# Altium schematic sheet 05_FPGA_SOC_Part1.SchDoc
size A3; SheetNumber: 5; SheetTotal: 8
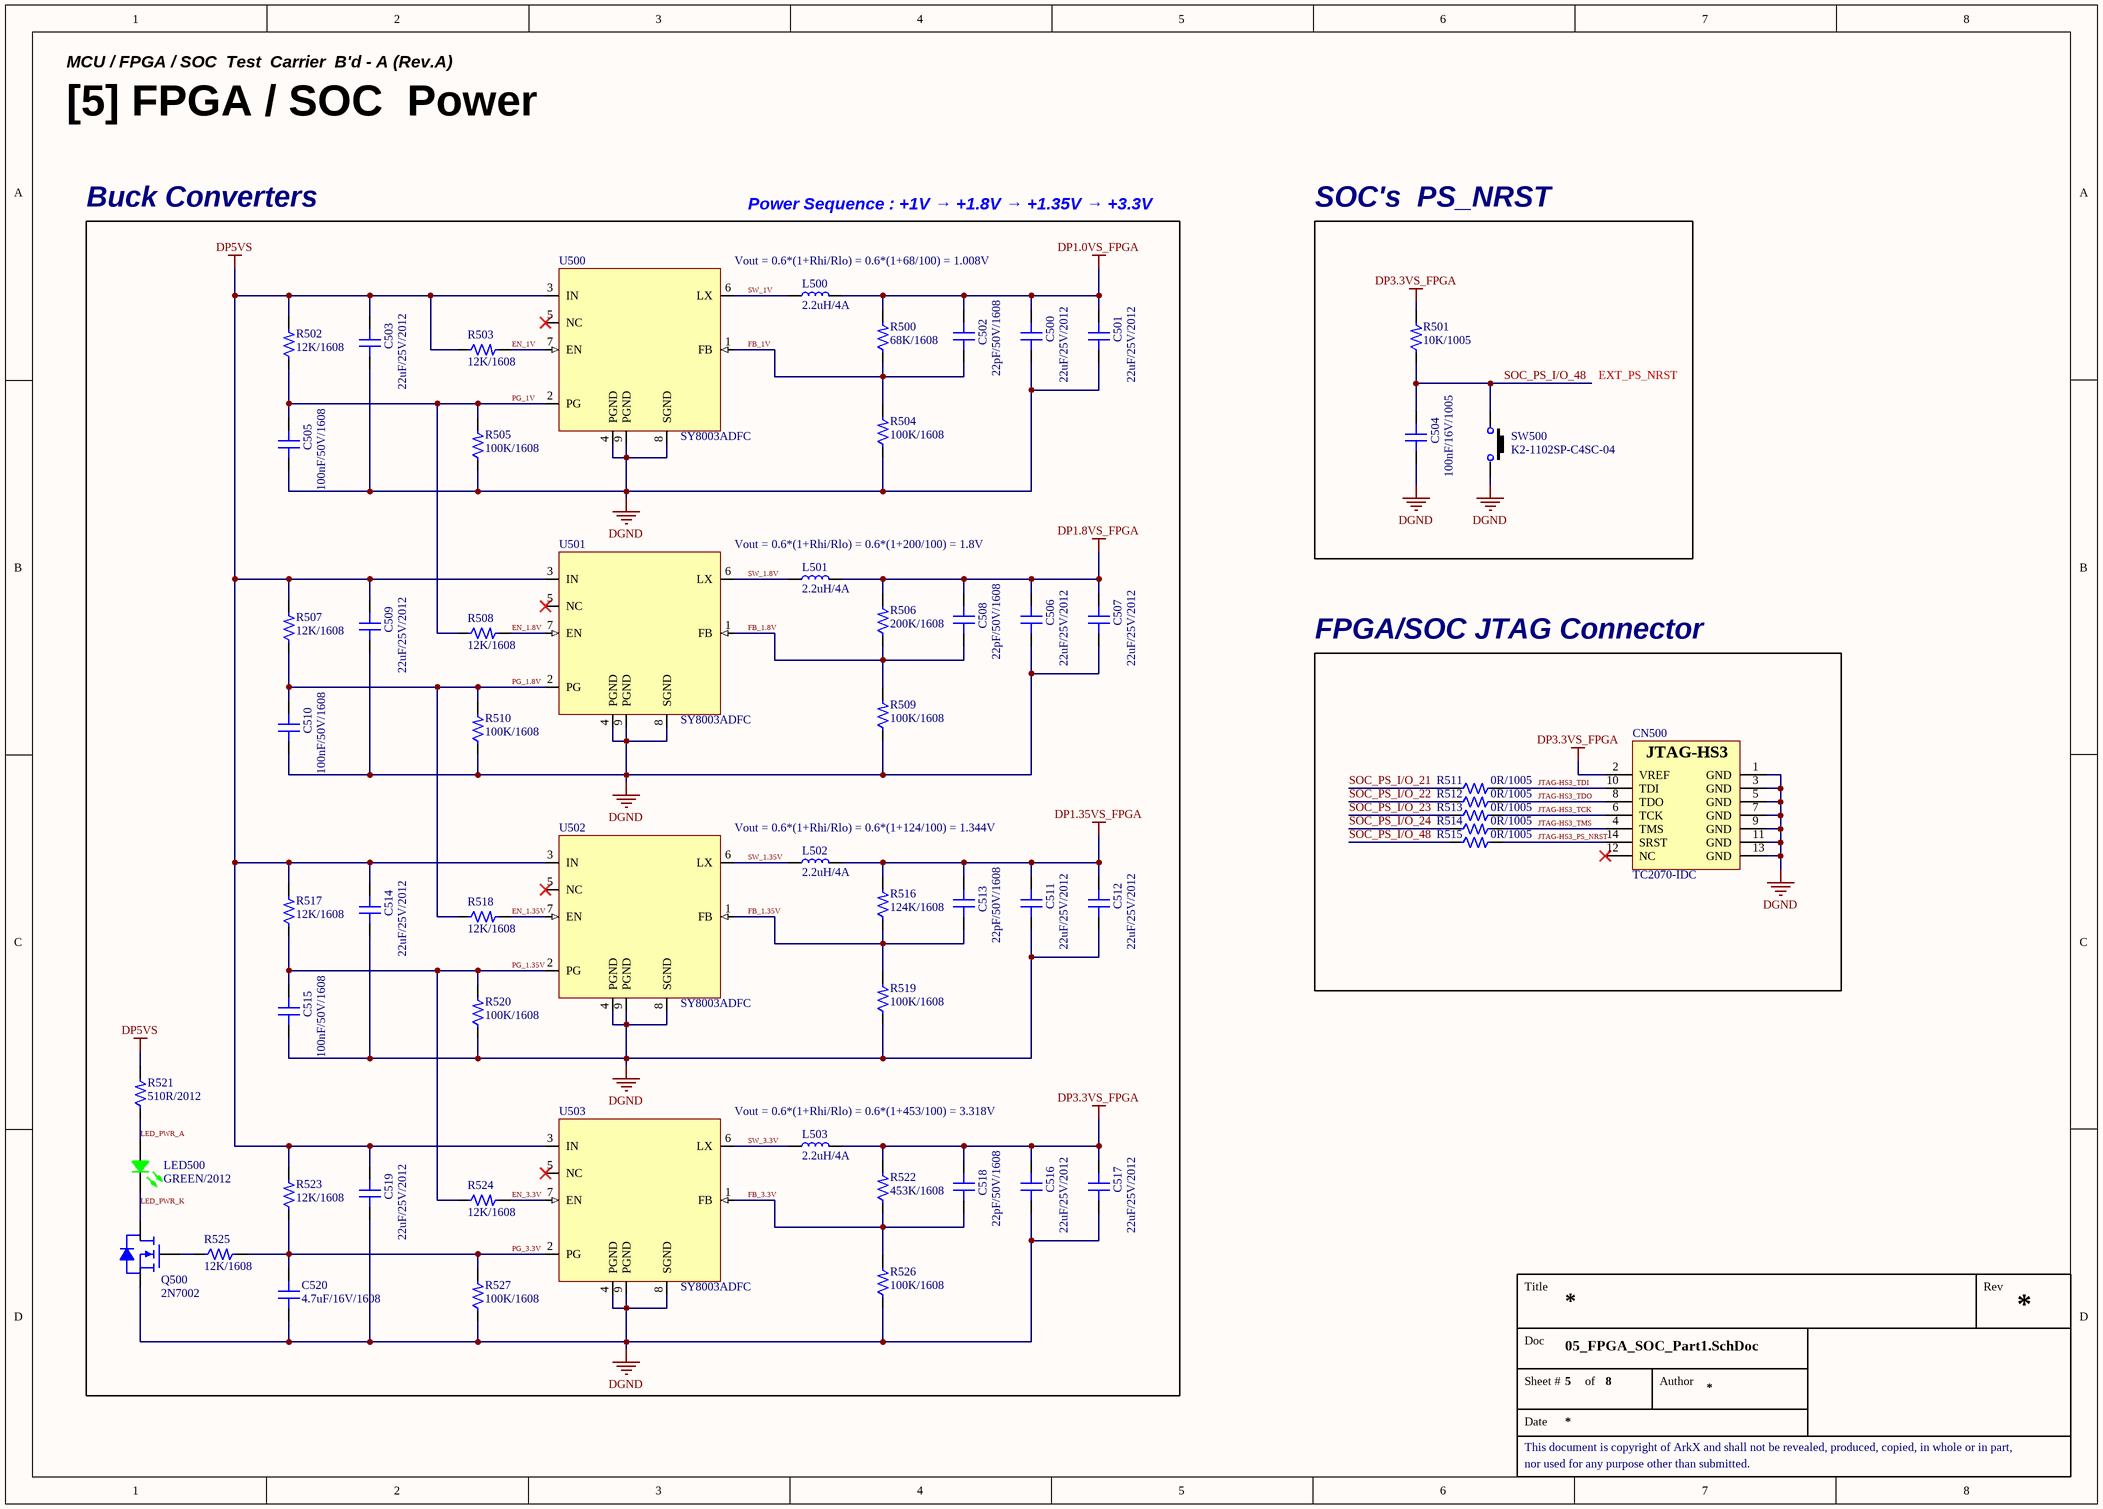
[diagram p0: 05_FPGA_SOC_Part1.SchDoc]

## Parts
C500  22uF/25V/2012  [CAP 2012 (0805_INCH)]
C501  22uF/25V/2012  [CAP 2012 (0805_INCH)]
C502  22pF/50V/1608  [CAP 1608 (0603_INCH)]
C503  22uF/25V/2012  [CAP 2012 (0805_INCH)]
C504  100nF/16V/1005  [CAP 1005 (0402_INCH)]
C505  100nF/50V/1608  [CAP 1608 (0603_INCH)]
C506  22uF/25V/2012  [CAP 2012 (0805_INCH)]
C507  22uF/25V/2012  [CAP 2012 (0805_INCH)]
C508  22pF/50V/1608  [CAP 1608 (0603_INCH)]
C509  22uF/25V/2012  [CAP 2012 (0805_INCH)]
C510  100nF/50V/1608  [CAP 1608 (0603_INCH)]
C511  22uF/25V/2012  [CAP 2012 (0805_INCH)]
C512  22uF/25V/2012  [CAP 2012 (0805_INCH)]
C513  22pF/50V/1608  [CAP 1608 (0603_INCH)]
C514  22uF/25V/2012  [CAP 2012 (0805_INCH)]
C515  100nF/50V/1608  [CAP 1608 (0603_INCH)]
C516  22uF/25V/2012  [CAP 2012 (0805_INCH)]
C517  22uF/25V/2012  [CAP 2012 (0805_INCH)]
C518  22pF/50V/1608  [CAP 1608 (0603_INCH)]
C519  22uF/25V/2012  [CAP 2012 (0805_INCH)]
C520  4.7uF/16V/1608  [CAP 1608 (0603_INCH)]
CN500  TC2070-IDC  [CON_TC2070-IDC]
L500  2.2uH/4A  [IND_2.2uH/4A/6x6_(BWVS006060282R2M00)]
L501  2.2uH/4A  [IND_2.2uH/4A/6x6_(BWVS006060282R2M00)]
L502  2.2uH/4A  [IND_2.2uH/4A/6x6_(BWVS006060282R2M00)]
L503  2.2uH/4A  [IND_2.2uH/4A/6x6_(BWVS006060282R2M00)]
LED500  GREEN/2012  [LED MHT170RGBCT (GREEN)]
Q500  2N7002  [SOT 23-3 (DIODES INCORPORATED)]
R500  68K/1608  [RES 1608 (0603_inch)]
R501  10K/1005  [RES 1005 (0402_inch)]
R502  12K/1608  [RES 1608 (0603_inch)]
R503  12K/1608  [RES 1608 (0603_inch)]
R504  100K/1608  [RES 1608 (0603_inch)]
R505  100K/1608  [RES 1608 (0603_inch)]
R506  200K/1608  [RES 1608 (0603_inch)]
R507  12K/1608  [RES 1608 (0603_inch)]
R508  12K/1608  [RES 1608 (0603_inch)]
R509  100K/1608  [RES 1608 (0603_inch)]
R510  100K/1608  [RES 1608 (0603_inch)]
R511  0R/1005  [RES 1005 (0402_inch)]
R512  0R/1005  [RES 1005 (0402_inch)]
R513  0R/1005  [RES 1005 (0402_inch)]
R514  0R/1005  [RES 1005 (0402_inch)]
R515  0R/1005  [RES 1005 (0402_inch)]
R516  124K/1608  [RES 1608 (0603_inch)]
R517  12K/1608  [RES 1608 (0603_inch)]
R518  12K/1608  [RES 1608 (0603_inch)]
R519  100K/1608  [RES 1608 (0603_inch)]
R520  100K/1608  [RES 1608 (0603_inch)]
R521  510R/2012  [RES 2012 (0805_inch)]
R522  453K/1608  [RES 1608 (0603_inch)]
R523  12K/1608  [RES 1608 (0603_inch)]
R524  12K/1608  [RES 1608 (0603_inch)]
R525  12K/1608  [RES 1608 (0603_inch)]
R526  100K/1608  [RES 1608 (0603_inch)]
R527  100K/1608  [RES 1608 (0603_inch)]
SW500  K2-1102SP-C4SC-04  [SW K2-1102SP-C4SC-04]
U500  SY8003ADFC  [IC_DFN_2X2_8L]
U501  SY8003ADFC  [IC_DFN_2X2_8L]
U502  SY8003ADFC  [IC_DFN_2X2_8L]
U503  SY8003ADFC  [IC_DFN_2X2_8L]

## Blocks framed on the sheet
Buck Converters: C500-C503 C505-C520 L500-L503 LED500 Q500 R500 R502-R510 R516-R527 U500-U503
SOC's  PS_NRST: C504 R501 SW500
FPGA/SOC JTAG Connector: CN500 R511-R515

## Nets
DGND: C500.1 C501.1 C503.1 C504.1 C505.1 C506.1 C507.1 C509.1 C510.1 C511.1 C512.1 C514.1 C515.1 C516.1 C517.1 C519.1 C520.1 CN500.1(GND) CN500.3(GND) CN500.5(GND) CN500.7(GND) CN500.9(GND) CN500.11(GND) CN500.13(GND) Q500.2(S) R504.1 R505.1 R509.1 R510.1 R519.1 R520.1 R526.1 R527.1 SW500.3 U500.4(PGND) U500.8(SGND) U500.9(PGND) U501.4(PGND) U501.8(SGND) U501.9(PGND) U502.4(PGND) U502.8(SGND) U502.9(PGND) U503.4(PGND) U503.8(SGND) U503.9(PGND)
DP1.0VS_FPGA: C500.2 C501.2 C502.2 L500.2 R500.2
DP1.8VS_FPGA: C506.2 C507.2 C508.2 L501.2 R506.2
DP1.35VS_FPGA: C511.2 C512.2 C513.2 L502.2 R516.2
DP3.3VS_FPGA: C516.2 C517.2 C518.2 CN500.2(VREF) L503.2 R501.2 R522.2
DP5VS: C503.2 C509.2 C514.2 C519.2 R502.2 R503.1 R507.2 R517.2 R521.2 R523.2 U500.3(IN) U501.3(IN) U502.3(IN) U503.3(IN)
EN_1.8V: R508.2 U501.7(EN)
EN_1.35V: R518.2 U502.7(EN)
EN_1V: R503.2 U500.7(EN)
EN_3.3V: R524.2 U503.7(EN)
FB_1.8V: C508.1 R506.1 R509.2 U501.1(FB)
FB_1.35V: C513.1 R516.1 R519.2 U502.1(FB)
FB_1V: C502.1 R500.1 R504.2 U500.1(FB)
FB_3.3V: C518.1 R522.1 R526.2 U503.1(FB)
JTAG-HS3_PS_NRST: CN500.14(SRST) R515.2
JTAG-HS3_TCK: CN500.6(TCK) R513.2
JTAG-HS3_TDI: CN500.10(TDI) R511.2
JTAG-HS3_TDO: CN500.8(TDO) R512.2
JTAG-HS3_TMS: CN500.4(TMS) R514.2
LED_PWR_A: LED500.4(Common_Anode) R521.1
LED_PWR_K: LED500.2(GREEN) Q500.3(D)
PG_1.8V: C510.2 R507.1 R510.2 R518.1 U501.2(PG)
PG_1.35V: C515.2 R517.1 R520.2 R524.1 U502.2(PG)
PG_1V: C505.2 R502.1 R505.2 R508.1 U500.2(PG)
PG_3.3V: C520.2 R523.1 R525.2 R527.2 U503.2(PG)
SOC_PS_I/O_21: R511.1
SOC_PS_I/O_22: R512.1
SOC_PS_I/O_23: R513.1
SOC_PS_I/O_24: R514.1
SOC_PS_I/O_48: C504.2 R501.1 R515.1 SW500.1
SW_1.8V: L501.1 U501.6(LX)
SW_1.35V: L502.1 U502.6(LX)
SW_1V: L500.1 U500.6(LX)
SW_3.3V: L503.1 U503.6(LX)
NetQ500_1: Q500.1(G) R525.1

Not connected (* = marked no-connect by the designer): CN500 12(NC)*; U500 5(NC)*; U501 5(NC)*; U502 5(NC)*; U503 5(NC)*

## Notes on the sheet
- MCU / FPGA / SOC  Test  Carrier  B'd - A (Rev.A)
- [5] FPGA / SOC  Power
- Power Sequence : +1V → +1.8V → +1.35V → +3.3V
- Vout = 0.6*(1+Rhi/Rlo) = 0.6*(1+68/100) = 1.008V
- EXT_PS_NRST
- Vout = 0.6*(1+Rhi/Rlo) = 0.6*(1+200/100) = 1.8V
- Vout = 0.6*(1+Rhi/Rlo) = 0.6*(1+124/100) = 1.344V
- Vout = 0.6*(1+Rhi/Rlo) = 0.6*(1+453/100) = 3.318V
- Title
- Rev
- Doc
- Sheet #
- of
- Author
- This document is copyright of ArkX and shall not be revealed, produced, copied, in whole or in part,
- Date
- nor used for any purpose other than submitted.
- (in symbol CON_TC2070-IDC(JTAG-HS3)) JTAG-HS3

## Library data of the parts
C500 C501 C503 C506 C507 C509 C511 C512 C514 C516 C517 C519 = CAP_22uF/25V/2012: Ceramic CAP_22uF/25V/2012; LCSC Part #: C45783; JLCPCB Part Type: Basic Part
C502 C508 C513 C518 = CAP_22pF/50V/1608: Ceramic CAP_22pF/50V/1608; LCSC Part #: C1653; JLCPCB Part Type: Basic Part
C504 = CAP_100nF/16V/1005: Ceramic CAP_100nF/16V/1005; LCSC Part #: C1525; JLCPCB Part Type: Basic Part
C505 C510 C515 = CAP_100nF/50V/1608: Ceramic CAP_100nF/50V/1608; LCSC Part #: C14663; JLCPCB Part Type: Basic Part
C520 = CAP_4.7uF/16V/1608: Ceramic CAP_4.7uF/16V/1608; LCSC Part #: C19666; JLCPCB Part Type: Basic Part
CN500 = CON_TC2070-IDC(JTAG-HS3): TC2070 14-pin Plug-of-Nails™ (with legs) to 14 pin 2mm female IDC connector.
L500-L503 = IND_2.2uH/4A/6x6: FIXED IND 2.2uH 4A 20mohm SMD; Part Name: BWVS006060282R2M00; LCSC Part #: C2838207; JLCPCB Part Type: Extended Part
LED500 = LED_MHT170RGBCT(GREEN): Colorless transparence -30℃~+85℃ Positive post Common anode RGB 120° 0805  Light Emitting Diodes (LED) ROHS; LCSC Part #: C2962094; JLCPCB Part Type: Extended Part
Q500 = FET_2N7002: 60V 115mA 200mW 7.5Ω@10V,500mA N Channel SOT-23  MOSFETs ROHS; LCSC Part #: C8545; JLCPCB Part Type: Basic Part
R500 = RES_68K/1608/0.1W: Value: 68K; Power Rating: 0.1W; Precision: 1%; Size: 1608; LCSC Part #: C23231; JLCPCB Part Type: Basic Part
R501 = RES_10K/1005/62.5mW: Value: 10K; Power Rating: 62.5mW; Precision: 1%; Size: 1005; LCSC Part #: C25744; JLCPCB Part Type: Basic Part
R502 R503 R507 R508 R517 R518 R523-R525 = RES_12K/1608/0.1W: Value: 12K; Power Rating: 0.1W; Precision: 1%; Size: 1608; LCSC Part #: C22790; JLCPCB Part Type: Basic Part
R504 R505 R509 R510 R519 R520 R526 R527 = RES_100K/1608/0.1W: Value: 100K; Power Rating: 0.1W; Precision: 1%; Size: 1608; LCSC Part #: C25803; JLCPCB Part Type: Basic Part
R506 = RES_200K/1608/0.1W: Value: 200K; Power Rating: 0.1W; Precision: 1%; Size: 1608; LCSC Part #: C25811; JLCPCB Part Type: Basic Part
R511-R515 = RES_0R/1005/62.5mW: Value: 0R; Power Rating: 62.5mW; Precision: 1%; Size: 1005; LCSC Part #: C17168; JLCPCB Part Type: Basic Part
R516 = RES_124K/1608/0.1W: Value: 124K; Power Rating: 0.1W; Precision: 1%; Size: 1608; LCSC Part #: C140118; JLCPCB Part Type: Extended Part
R521 = RES_510R/2012/0.125W: Value: 510R; Power Rating: 0.125W; Precision: 1%; Size: 2012; LCSC Part #: C17734; JLCPCB Part Type: Basic Part
R522 = RES_453K/1608/0.1W: Value: 453K; Power Rating: 0.1W; Precision: 1%; Size: 1608; LCSC Part #: C25818; JLCPCB Part Type: Extended Part
SW500 = SW_K2-1102SP-C4SC-04(2P): -25℃~+85℃ 6mm 5mm Round Button 50mA Brick nogging 6mm SPST 100MΩ 100000 250gf@±30gf 12V SMD  Tactile Switches ROHS; LCSC Part #: C127509; JLCPCB Part Type: Extended Part
U500-U503 = IC_REG_SY8003ADFC: High Efficiency 5.5V, 3A Continuous, 1MHz Synchronous Step Down Regulator; Manufacturer: Silergy; Manufacturer Part Number: High Efficiency 5.5V, 3A continuous, 1MHz; JLCPCB Part Type: Extended Part; LCSC Part #: C178236